# EAGLE design ikoka-nano (EAGLE 9.6.2)
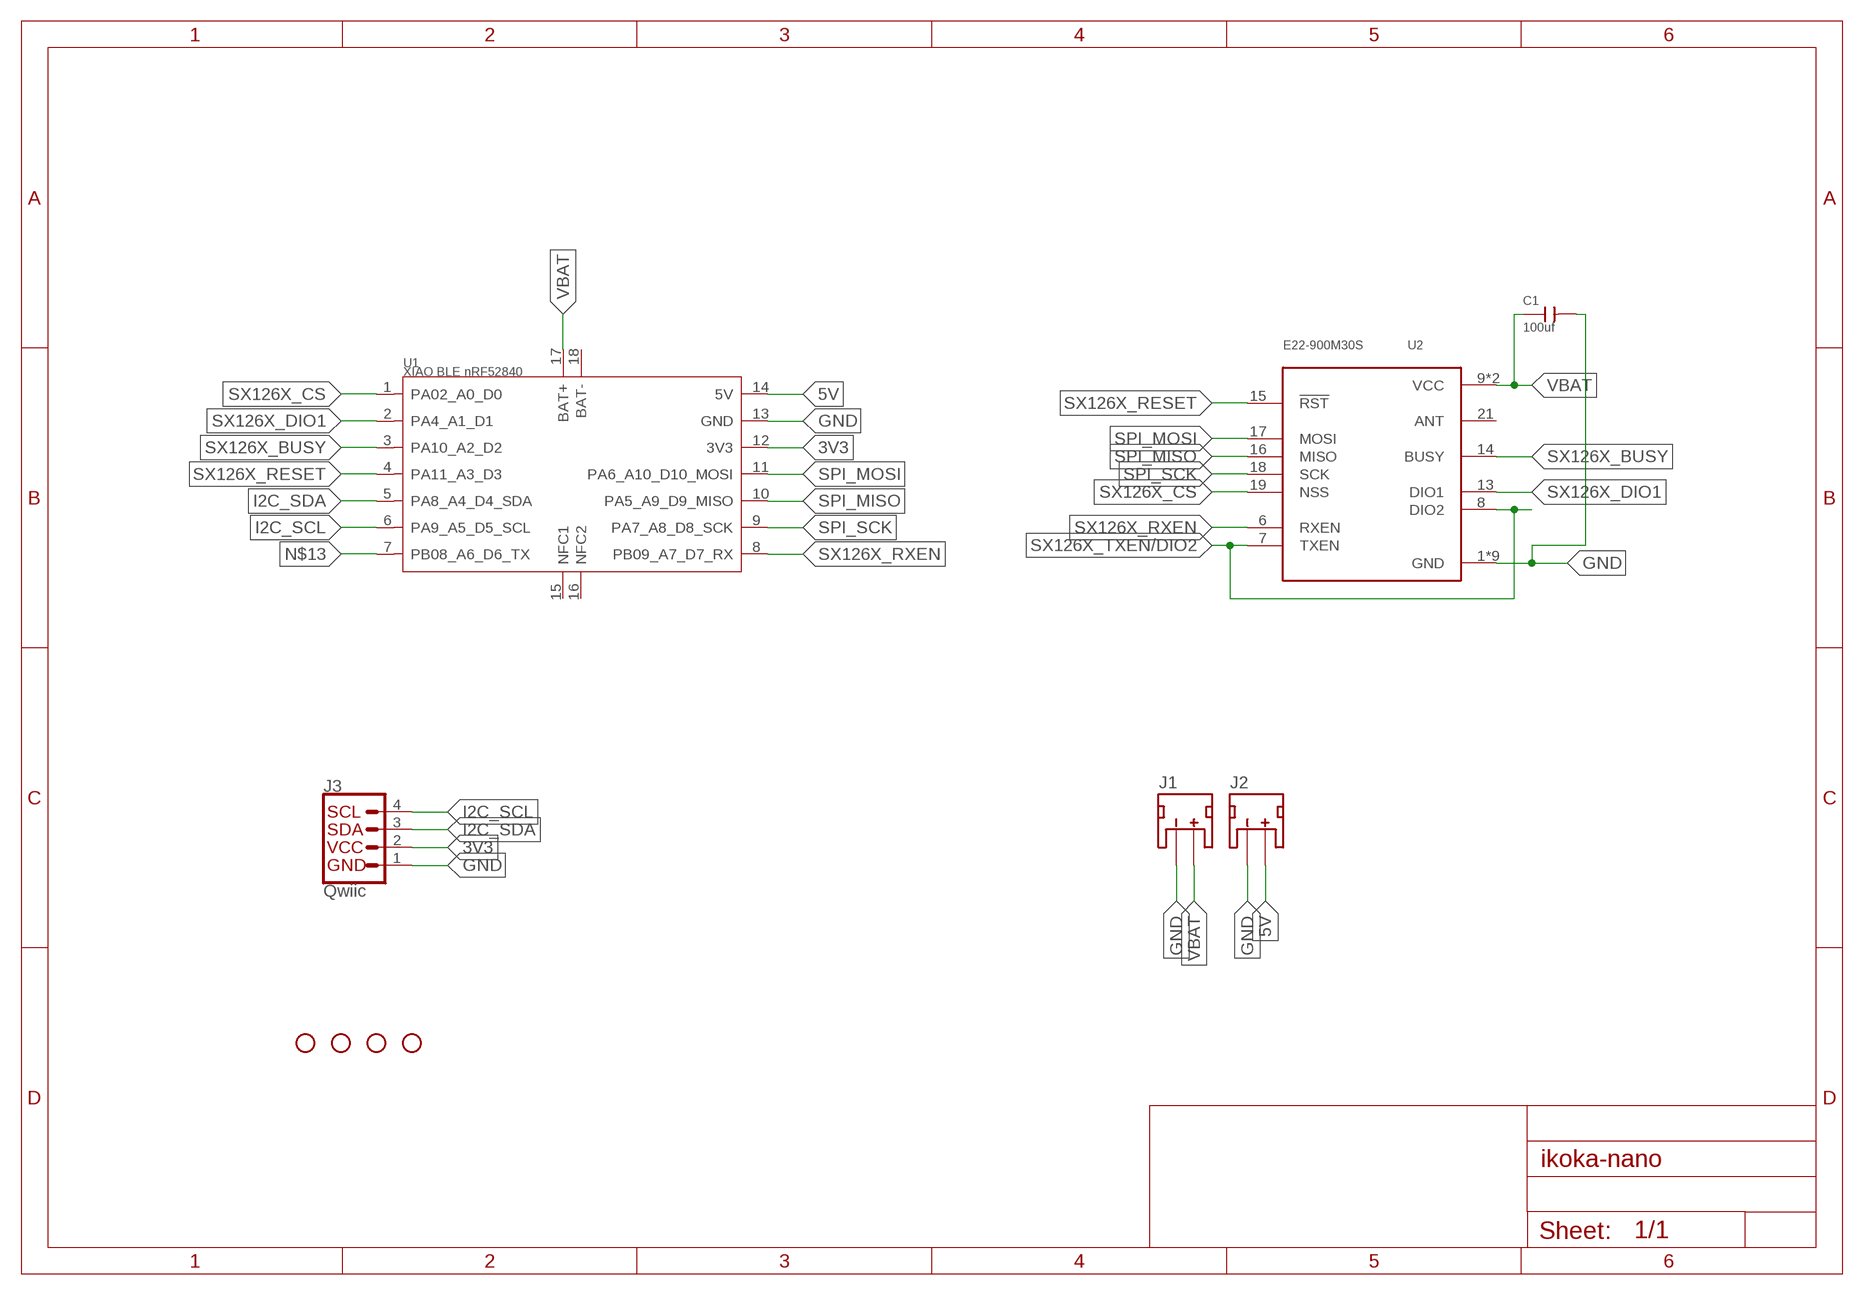
[diagram p0: schematic, sheet 1]

## Parts
C1  100uf  CERAMIC-100UF-6.3V-20%-X5R(1206)  [C1206]
H1  STAND-OFF  [STAND-OFF]
H2  STAND-OFF  [STAND-OFF]
H3  STAND-OFF  [STAND-OFF]
H4  STAND-OFF  [STAND-OFF]
J1  LiPo 1S  JST_2MM_MALE  [JST-2-SMD]
J2  Solar ≤6.45V  JST_2MM_MALE  [JST-2-SMD]
J3  Qwiic  QWIIC_CONNECTORJS-1MM  [JST04_1MM_RA]
U1  XIAO BLE nRF52840  MOUDLE-SEEEDUINO-XIAO-NRF52840-SMD  [MOUDLE16P-SMD-2.54-21X17.8MM]
U2  E22-900M30S  [XCVR_E22-900M30S]

## Nets
3V3 [pwr]: J3.2 U1.12(3V3)
5V [pwr]: J2.2(+) U1.14(5V)
GND [pwr]: C1.2 J1.1(-) J2.1(-) J3.1 U1.13(GND) U2.1(GND) U2.2(GND) U2.3(GND) U2.4(GND) U2.5(GND) U2.11(GND) U2.12(GND) U2.20(GND) U2.22(GND)
I2C_SCL: J3.4 U1.6(PA9_A5_D5_SCL)
I2C_SDA: J3.3 U1.5(PA8_A4_D4_SDA)
N$13: U1.7(PB08_A6_D6_TX)
SPI_MISO: U1.10(PA5_A9_D9_MISO) U2.16(MISO)
SPI_MOSI: U1.11(PA6_A10_D10_MOSI) U2.17(MOSI)
SPI_SCK: U1.9(PA7_A8_D8_SCK) U2.18(SCK)
SX126X_BUSY: U1.3(PA10_A2_D2) U2.14(BUSY)
SX126X_CS: U1.1(PA02_A0_D0) U2.19(NSS)
SX126X_DIO1: U1.2(PA4_A1_D1) U2.13(DIO1)
SX126X_RESET: U1.4(PA11_A3_D3) U2.15(!RST)
SX126X_RXEN: U1.8(PB09_A7_D7_RX) U2.6(RXEN)
SX126X_TXEN/DIO2: U2.7(TXEN) U2.8(DIO2)
VBAT [pwr]: C1.1 J1.2(+) U1.17(BAT+) U2.9(VCC) U2.10(VCC)
Unconnected: J1.NC1(PAD1) J1.NC2(PAD2) J2.NC1(PAD1) J2.NC2(PAD2) U1.15(NFC1) U1.16(NFC2) U1.18(BAT-) U2.21(ANT)

## Library data of the parts
C1 = OPL_Capacitor:CERAMIC-100UF-6.3V-20%-X5R(1206): 302010183; MPN: GRM31CR60J107ME39L
H1-H4 = SparkFun-Hardware:STAND-OFF: Stand Off Drill holes for mechanically mounting via screws, standoffs, etc. Note: Use the keepout ring to avoid running the screw head into surrounding components. Variant Overviews STAND-OFF - Mechanical footprint for a #4 phillips button head screw. STAND-OFF-TIGHT - Mechanical footprint for a #4 phillips button head screw, Example SparkFun Products Screw - Phillips Head (1/4", 4-40, 10 pack) <https://www.sparkfun.com/products/10453> (PRT-10453) Screw - Phillips Head (1/2", 4-40, 10 pack) <https://www.sparkfun.com/products/10452> (PRT-10452) Screw - Phillips Head (3/4", 4-40, 10 pack) <https://www.sparkfun.com/products/10451> (PRT-10451) Screw - Phillips Head (1", 4-40, 10 pack) <https://www.sparkfun.com/products/10450> (PRT-10450)
J1 J2 = SparkFun-Connectors:JST_2MM_MALE: JST 2MM MALE RA CONNECTOR Two pin, compact surface mount connector. Commonly used as a battery input connection point. We really like the solid locking feeling and high current rating on these small connectors. We use these all the time as battery connectors. Mates to single-cell LiPo batteries. Here is the connector we sell at SparkFun: JST Right Angle Connector - White <https://www.sparkfun.com/products/8612> (PRT-08612) Datasheet <http://www.sparkfun.com/datasheets/Prototyping/Connectors/JST-Horizontal.pdf> It was used on these SparkFun products: SparkFun MOSFET Power Controller <https://www.sparkfun.com/products/11214> (PRT-11214) SparkFun Battery Babysitter - LiPo Battery Manager <https://www.sparkfun.com/products/13777> (PRT-13777) And many, many others that required a lipo battery connection.; PROD_ID: CONN-11443; SF_ID: PRT-08612
J3 = SparkFun-Connectors:QWIIC_CONNECTOR: SparkFun I2C Standard Qwiic Connector An SMD 1mm pitch JST connector makes it easy and quick (get it? Qwiic?) to connect I2C devices to each other. The Qwiic system <http://www.sparkfun.com/qwiic> enables fast and solderless connection between popular platforms and various sensors and actuators. We carry 200mm <https://www.sparkfun.com/products/14204>, 100mm <https://www.sparkfun.com/products/14205>, 50mm <https://www.sparkfun.com/products/14206>, and breadboard friendly <https://www.sparkfun.com/products/14207> Qwiic cables. We also offer 10 pcs strips <https://www.sparkfun.com/products/14323> the SMD connectors.; PROD_ID: CONN-13694; VALUE: QWIIC_RIGHT_ANGLE
U1 = Seeed-Studio-XIAO-nRF52840-footprint-eagle:MOUDLE-SEEEDUINO-XIAO-NRF52840
U2 = E22-900M30S:E22-900M30S: Check availability <https://pricing.snapeda.com/parts/E22-900M30S/EBYTE/view-part?ref=eda>; AVAILABILITY: Not in stock; CHECK_PRICES: https://www.snapeda.com/parts/E22-900M30S/EBYTE/view-part/?ref=eda; DESCRIPTION: SX1262 868/915 MHz 1w SPI LoRa Module; MF: EBYTE; MP: E22-900M30S; PACKAGE: Package; PRICE: None; SNAPEDA_LINK: https://www.snapeda.com/parts/E22-900M30S/EBYTE/view-part/?ref=snap

## Net classes
1 pwr: width 0.305 mm

## Board
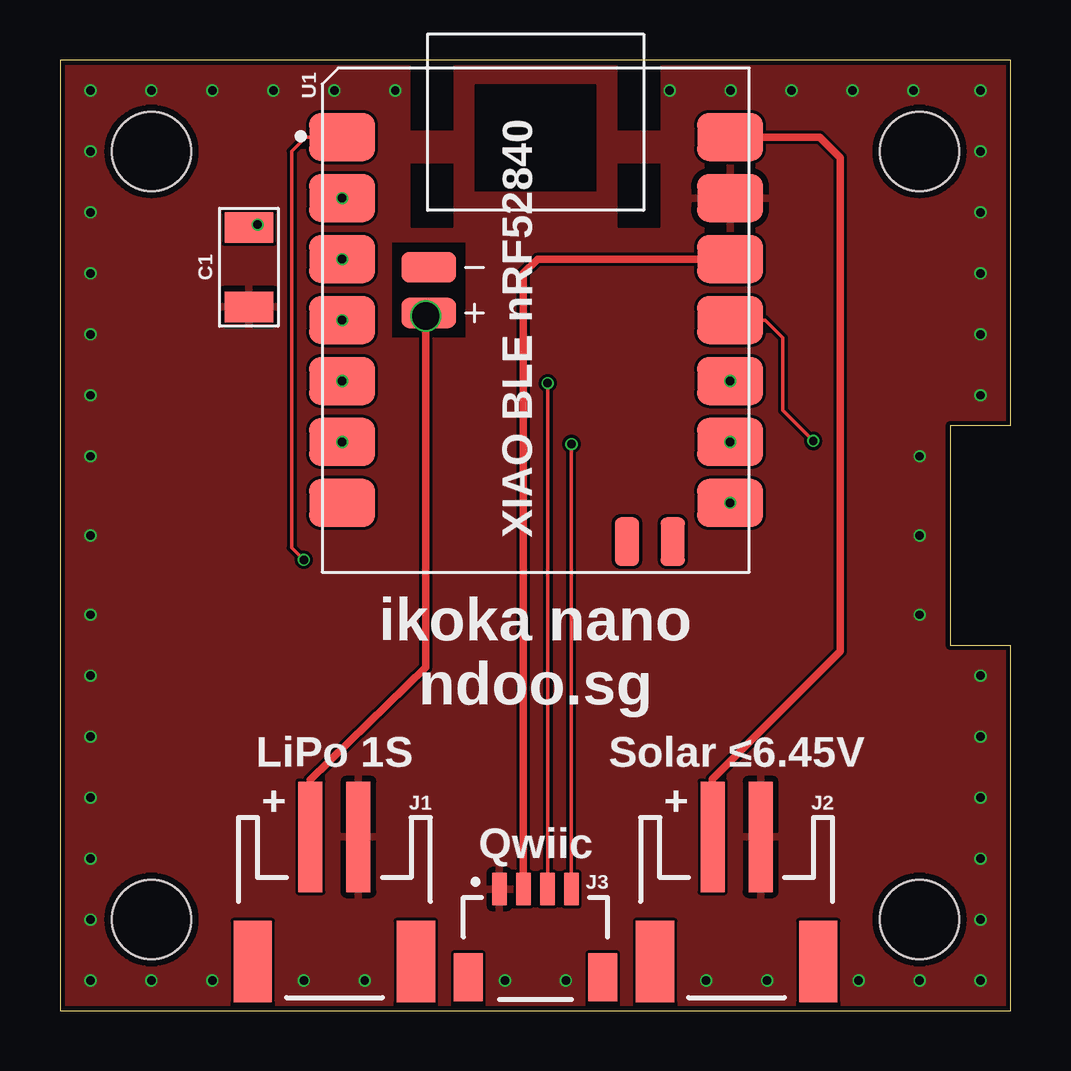
[diagram p1: board, top side]
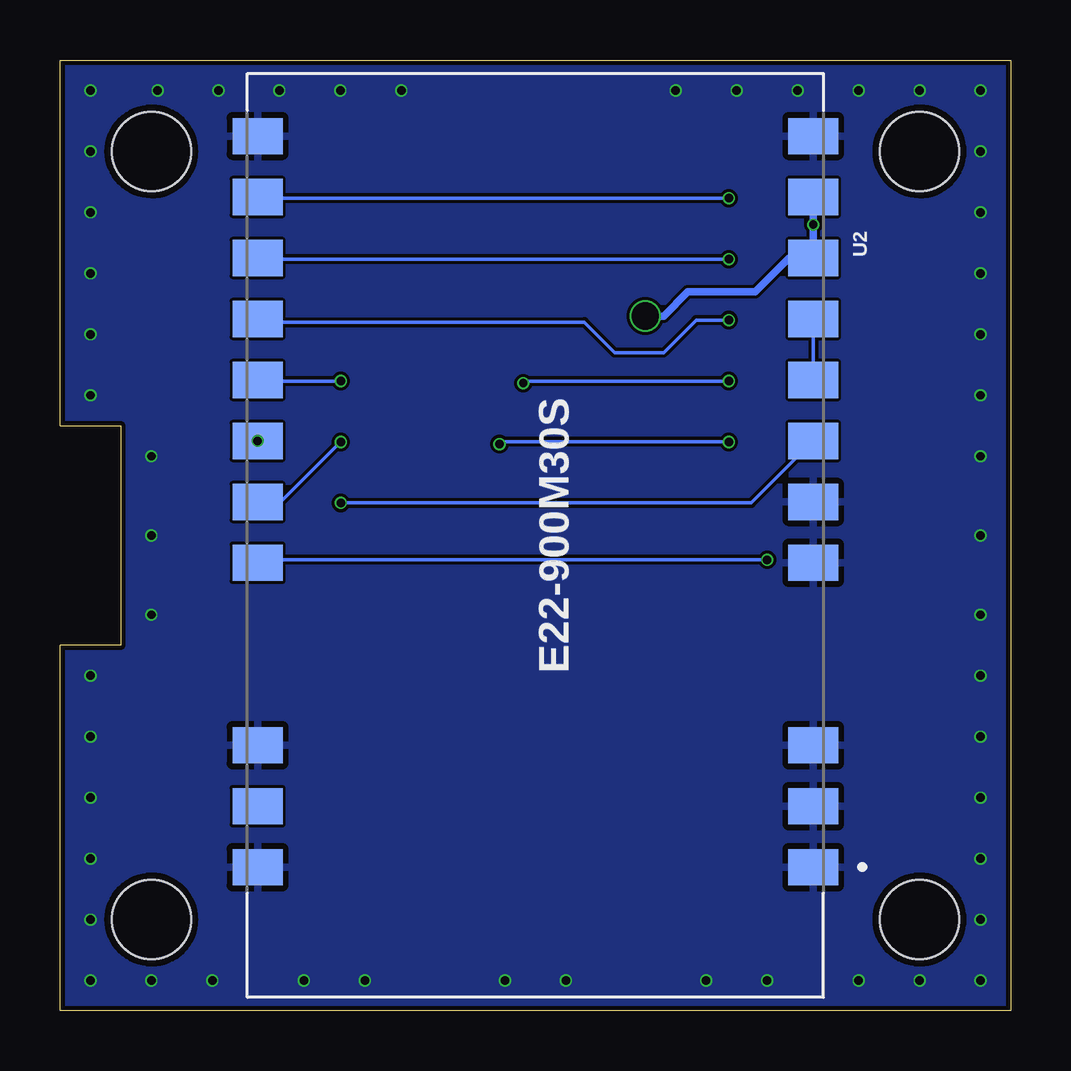
[diagram p2: board, bottom side, seen from below]

Size 39.62 x 39.62 mm. Coordinates in mm from the lower left corner, seen from the top.
Outline: 0,0 39.62,0 39.62,15.24 37.08,15.24 37.08,24.38 39.62,24.38 39.62,39.62 0,39.62 0,0
Copper layers (1*16): Top 0.035mm / dielectric 1.6mm / Bottom 0.035mm
Design rules "jlcpcb-2layers *": minimum track width 5mil, minimum drill 0.3mm, track to track 5mil, track to pad 5mil, pad to pad 5mil, via to via 5mil, smd to smd 5mil, copper to edge 0.2mm, drill to drill 6mil, minimum pad ring 10mil, minimum via ring 3mil, stop-mask expansion 4mil, vias tented up to drill 14mil, thermal gap 10mil

### Footprints (pad centres in the part's own frame; a part is rotated, then mirrored left to right if it is on the bottom)
C1206 = smd 1.27 x 2.032: 1 -1.651,0; 2 1.651,0
STAND-OFF = hole 3.302: 0,0
JST-2-SMD = smd 1 x 4.6: 1 -1,-3.7; 2 1,-3.7 | smd 1.6 x 3.4: NC1 -3.4,1.5; NC2 3.4,1.5
JST04_1MM_RA = smd 0.6 x 1.35: 1 -1.5,0; 2 -0.5,0; 3 0.5,0; 4 1.5,0 | smd 1.2 x 2: NC1 2.8,-3.675; NC2 -2.8,-3.675
MOUDLE16P-SMD-2.54-21X17.8MM = smd 2.75 x 2: 1 -8.055,7.96; 2 -8.055,5.42; 3 -8.055,2.88; 4 -8.055,0.34; 5 -8.055,-2.2; 6 -8.055,-4.74; 7 -8.055,-7.28; 8 8.11,-7.28; 9 8.11,-4.74; 10 8.11,-2.2; 11 8.11,0.34; 12 8.11,2.88; 13 8.11,5.42; 14 8.11,7.96 | smd 1.016 x 2.032: 15 3.81,-8.89; 16 5.715,-8.89 | smd 2.286 x 1.27: 17 -4.445,0.635; 18 -4.445,2.54
XCVR_E22-900M30S = smd 2.08 x 1.51: 1 11.575,-13.82; 2 11.575,-11.28; 3 11.575,-8.74; 4 11.575,-1.14; 5 11.575,1.4; 6 11.575,3.94; 7 11.575,6.48; 8 11.575,9.02; 9 11.575,11.56; 10 11.575,14.1; 11 11.575,16.64; 12 -11.575,16.64; 13 -11.575,14.1; 14 -11.575,11.56; 15 -11.575,9.02; 16 -11.575,6.48; 17 -11.575,3.94; 18 -11.575,1.4; 19 -11.575,-1.14; 20 -11.575,-8.74; 21 -11.575,-11.28; 22 -11.575,-13.82

### Placement (x,y rotation side)
C1  7.87,30.99 270 top
H1  3.81,3.81 0 top
H2  35.81,3.81 0 top
H3  35.81,35.81 0 top
H4  3.81,35.81 0 top
J1  11.43,3.56 180 top
J2  28.19,3.56 180 top
J3  19.81,5.08 0 top
U1  19.81,28.45 0 top
U2  19.81,19.81 0 bottom

### Tracks (layer width: path | path; a pad name or v marks a point on that pad's centre or on a via)
3V3
  Top 0.305: J3.2 19.31,30.73 19.91,31.33 U1.12
5V
  Top 0.305: U1.14 31.66,36.41 32.51,35.56 32.51,14.99 27.18,9.65 27.18,7.27 J2.2
GND  (via drill 0.35)
  other vias: 1.27,1.27 1.27,3.81 1.27,6.35 1.27,8.89 1.27,25.65 1.27,28.19 1.27,33.27 1.27,35.81 1.27,38.35 1.27,30.73 1.27,23.11 1.27,16.51 1.27,11.43 1.27,13.97 1.27,19.81 38.35,1.27 38.35,3.81 38.35,6.35 38.35,8.89 38.35,25.65 38.35,28.19 38.35,33.27 38.35,35.81 38.35,38.35 38.35,30.73 35.81,23.11 35.81,16.51 38.35,11.43 38.35,13.97 35.81,19.81 3.81,38.35 6.35,38.35 8.89,38.35 11.43,38.35 13.97,38.35 35.56,38.35 33.02,38.35 30.48,38.35 27.94,38.35 25.4,38.35 35.81,1.27 33.27,1.27 3.81,1.27 6.35,1.27 10.16,1.27 12.7,1.27 29.46,1.27 26.92,1.27 18.54,1.27 21.08,1.27
  pour Bottom: 0,39.62 0,0 39.62,0 39.62,39.62
  pour Top: 0,39.62 0,0 39.62,0 39.62,39.62
I2C_SCL  (via drill 0.35)
  Top 0.152: J3.4 v21.31,23.62
  Bottom 0.152: U1.6 21.25,23.71 21.34,23.62 v21.31,23.62
  other vias: 11.76,23.71
I2C_SDA  (via drill 0.35)
  Top 0.152: v20.32,26.16 J3.3
  Bottom 0.152: U1.5 20.23,26.25 v20.32,26.16
  other vias: 11.76,26.25
SPI_MISO  (via drill 0.35)
  Bottom 0.152: U1.10 31.39,26.25 U2.16
  other vias: 27.92,26.25
SPI_MOSI  (via drill 0.35)
  Top 0.152: U2.17 30.12,25.02 30.12,28.05 29.38,28.79 U1.11
  other vias: 31.39,23.75
SPI_SCK  (via drill 0.35)
  Bottom 0.152: U1.9 30.42,21.21 U2.18
  other vias: 27.92,23.71
SX126X_BUSY  (via drill 0.35)
  Bottom 0.152: U2.14 31.34,31.33 U1.3
  other vias: 11.76,31.33
SX126X_CS  (via drill 0.35)
  Top 0.152: U1.1 10.25,36.41 9.65,35.81 9.65,19.3 v10.16,18.8
  Bottom 0.152: v10.16,18.8 31.39,18.8 U2.19
SX126X_DIO1  (via drill 0.35)
  Bottom 0.152: U1.2 31.39,33.87 U2.13
  other vias: 11.76,33.87
SX126X_RESET  (via drill 0.35)
  Bottom 0.152: U1.4 13.12,28.79 14.48,27.43 16.51,27.43 17.78,28.7 31.39,28.7 U2.15
  other vias: 11.76,28.79
SX126X_RXEN  (via drill 0.35)
  Bottom 0.152: U1.8 10.82,21.17 U2.6
  other vias: 27.92,21.17
SX126X_TXEN/DIO2
  Bottom 0.152: U2.8 U2.7
VBAT  (via drill 0.35, 1.14)
  Top 0.305: J1.2 10.43,9.64 15.24,14.32 v15.24,28.96 U1.17 | C1.1 8,32.77 v8.24,32.77
  Bottom 0.305: v15.24,28.96 14.48,28.96 13.46,29.97 10.65,29.97 9.25,31.37 U2.9 v8.24,32.77 U2.10

### Text on the board
tNames: ikoka nano / ndoo.sg | + | + | Qwiic